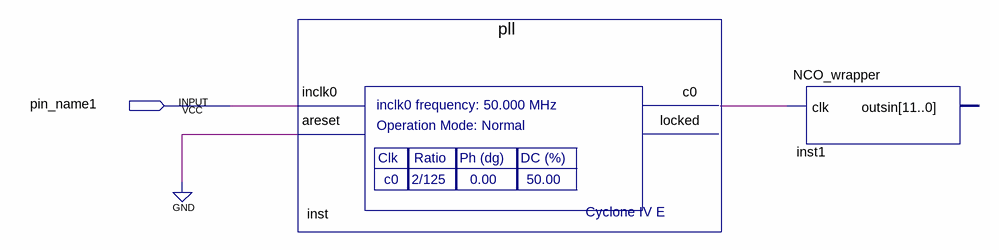
[diagram p0: schematic sheet]
// Quartus schematic block.bdf as structural Verilog: 2 symbols, 1 pins
module block (
  input  pin_name1
);

  wire inst_c0;

  pll inst (.inclk0(pin_name1), .areset(1'b0), .c0(inst_c0));  // open: locked
  NCO_wrapper inst1 (.clk(inst_c0));  // open: outsin
endmodule
